# EAGLE schematic Zegar (EAGLE 5.06)
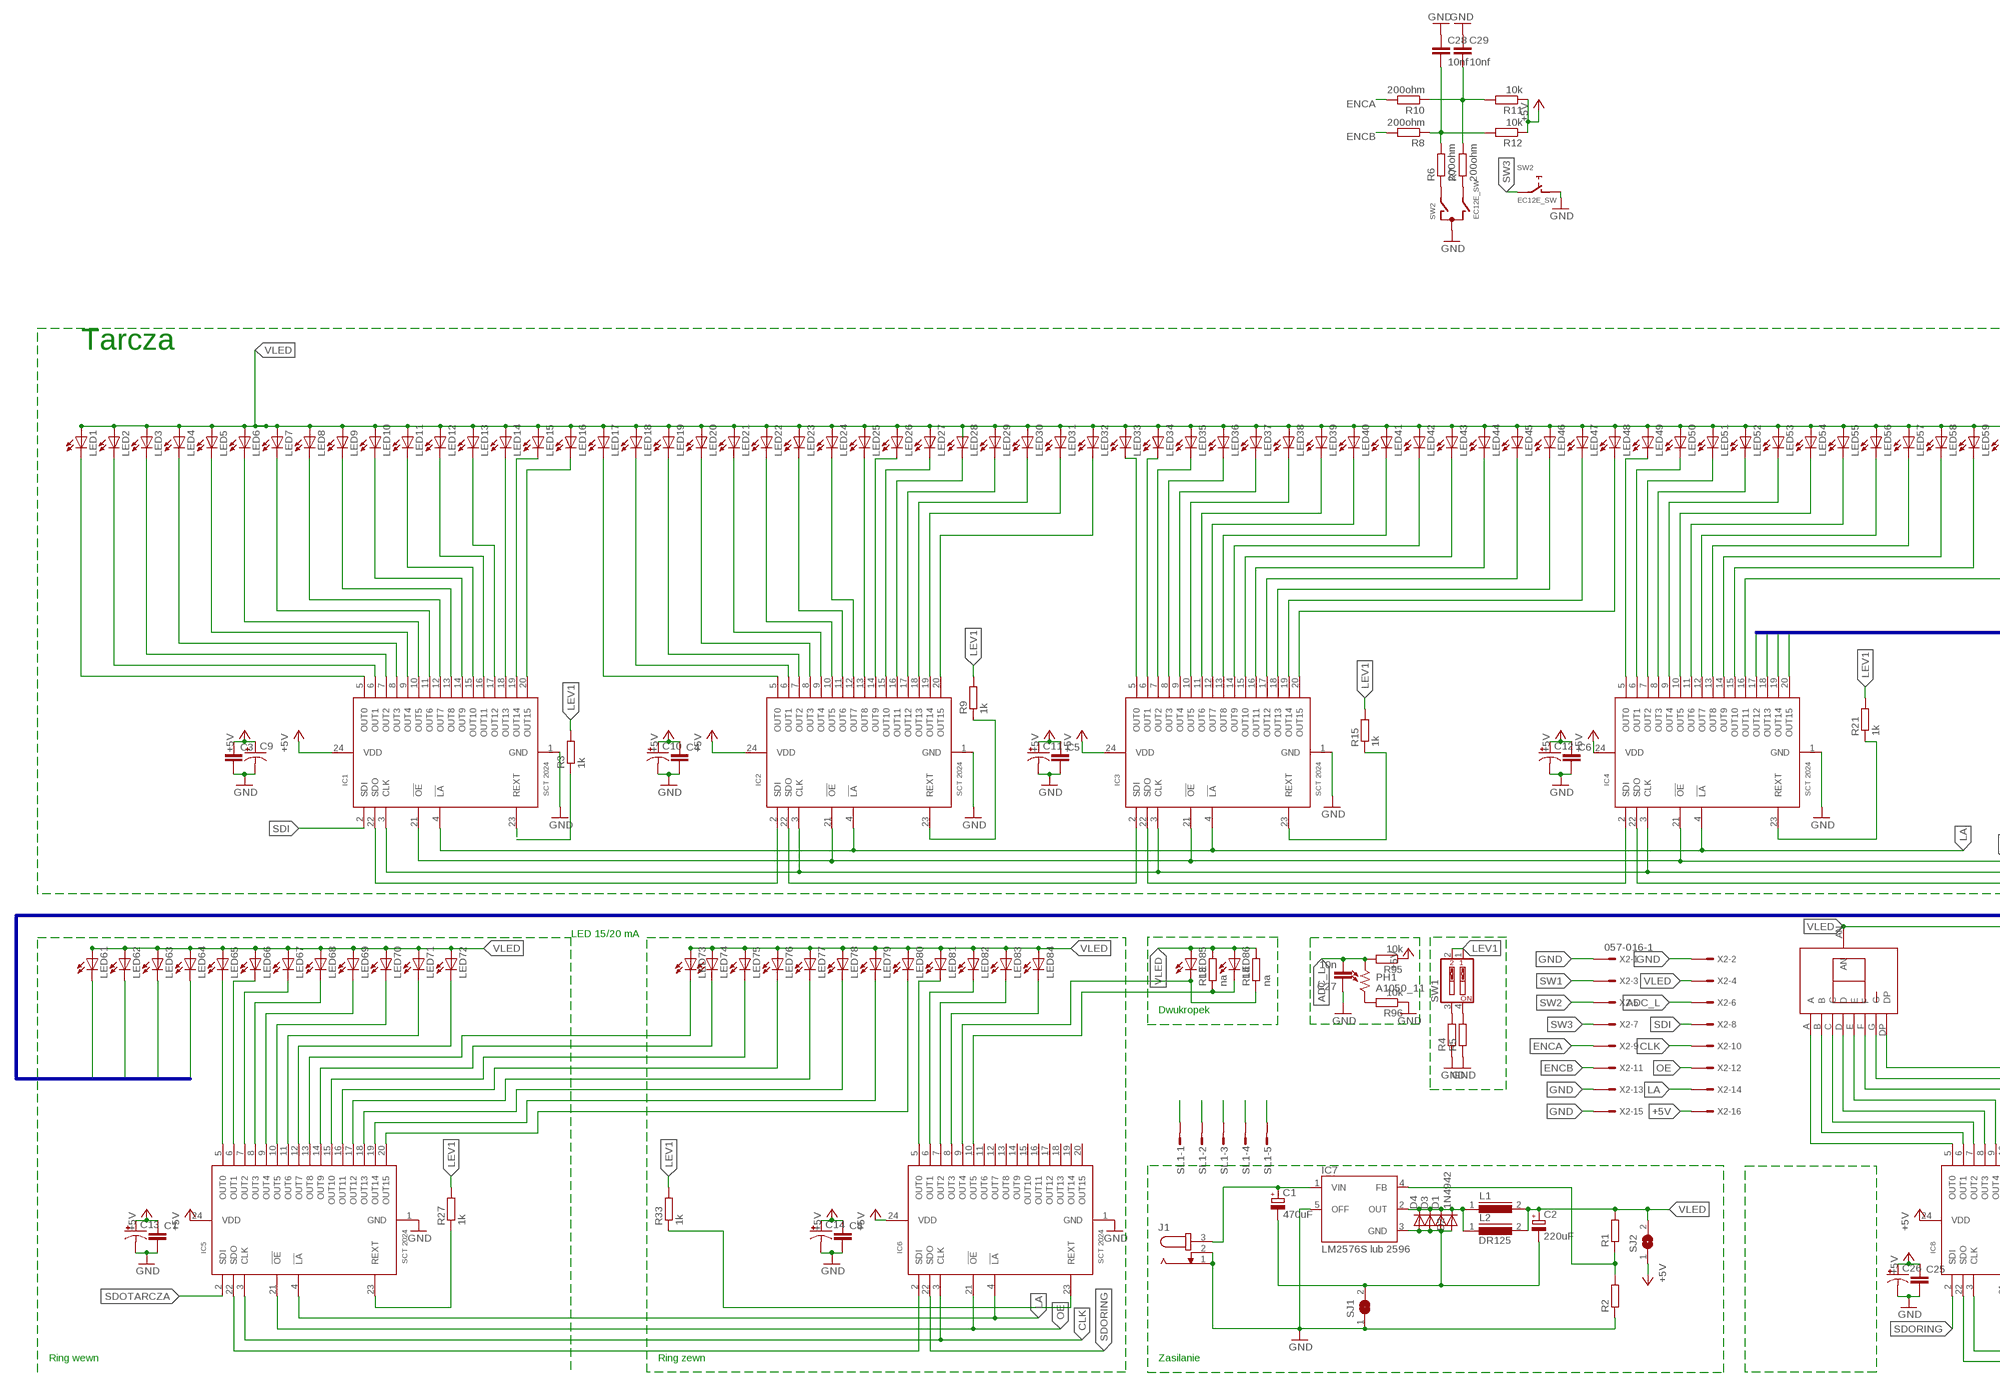
[diagram p0: schematic, sheet 1, part 1 of 2]
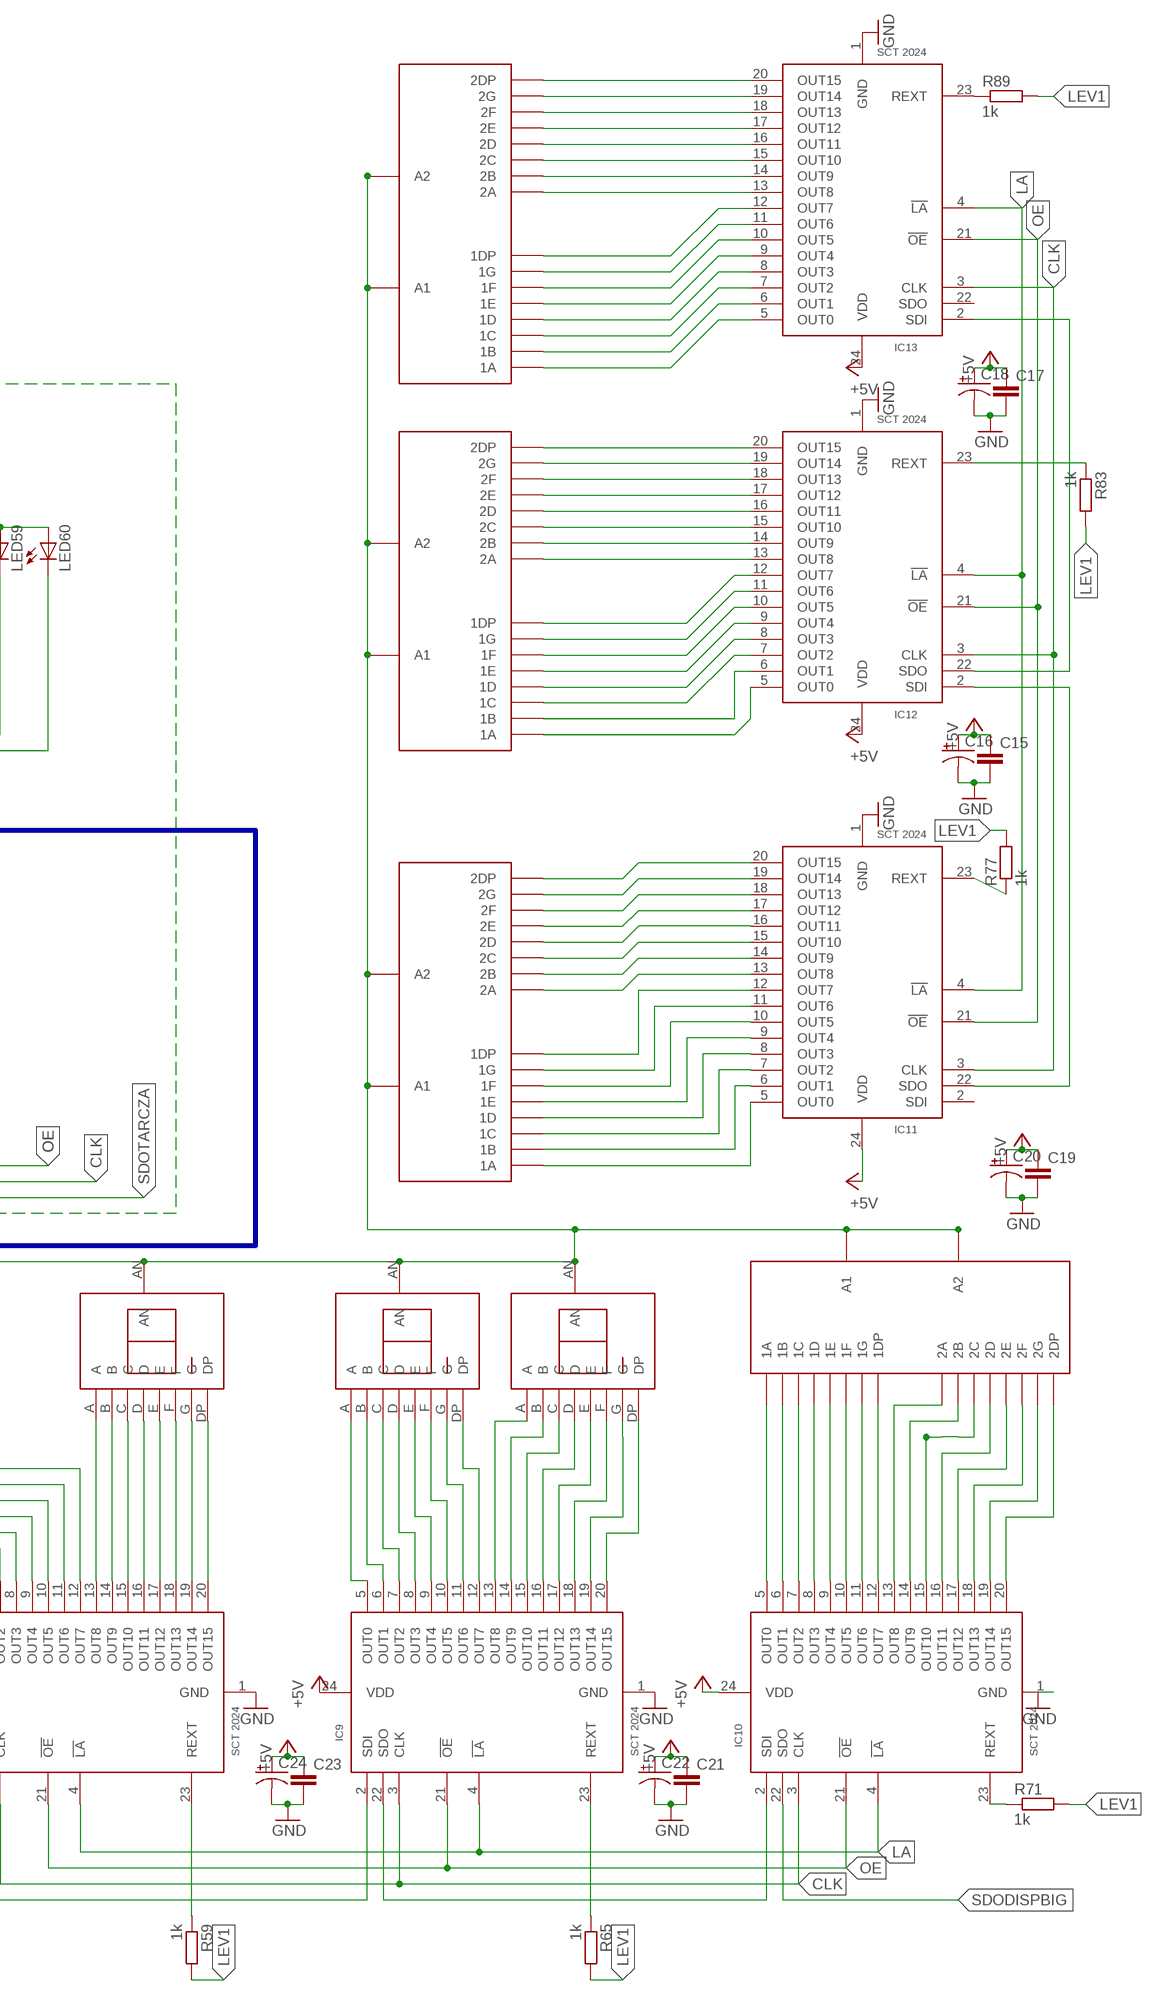
[diagram p1: schematic, sheet 1, part 2 of 2]

## Parts
C1  470uF  CPOL-EUE2.5-5  [E2,5-5]
C2  220uF  CPOL-EUE3.5-10  [E3,5-10]
C3  C-EUC1206K  [C1206K]
C4  C-EUC1206K  [C1206K]
C5  C-EUC1206K  [C1206K]
C6  C-EUC1206K  [C1206K]
C7  C-EUC1206K  [C1206K]
C8  C-EUC1206K  [C1206K]
C9  CPOL-USE/7260-38W  [E/7260-38W]
C10  CPOL-USE/7260-38W  [E/7260-38W]
C11  CPOL-USE/7260-38W  [E/7260-38W]
C12  CPOL-USE/7260-38W  [E/7260-38W]
C13  CPOL-USE/7260-38W  [E/7260-38W]
C14  CPOL-USE/7260-38W  [E/7260-38W]
C15  C-EUC1206K  [C1206K]
C16  CPOL-USE/7260-38W  [E/7260-38W]
C17  C-EUC1206K  [C1206K]
C18  CPOL-USE/7260-38W  [E/7260-38W]
C19  C-EUC1206K  [C1206K]
C20  CPOL-USE/7260-38W  [E/7260-38W]
C21  C-EUC1206K  [C1206K]
C22  CPOL-USE/7260-38W  [E/7260-38W]
C23  C-EUC1206K  [C1206K]
C24  CPOL-USE/7260-38W  [E/7260-38W]
C25  C-EUC1206K  [C1206K]
C26  CPOL-USE/7260-38W  [E/7260-38W]
C27  10n  C-EUC1206K  [C1206K]
C28  10nf  C-EUC1206K  [C1206K]
C29  10nf  C-EUC1206K  [C1206K]
D1  1N4942  [DO41-10]
D2  D-SMB  [SMB]
D3  DIODE-MELF-MLL41  [MELF-MLL41]
D4  DIODE-C2673  [C2673]
DL_S1  DISPL_LED_MALY_PODW_JJ  [DISPLEDMALYPODW]
DL_S2  DISPL_LED_MALY_PODW_JJ  [DISPLEDMALYPODW]
DL_S3  DISPL_LED_MALY_PODW_JJ  [DISPLEDMALYPODW]
DL_S4  DISPL_LED_MALY_PODW_JJ  [DISPLEDMALYPODW]
DUZY_JJ1  DISP-LED-DUZY-POL_JJ  [DISPLEDDUZYPOL]
DUZY_JJ2  DISP-LED-DUZY-POL_JJ  [DISPLEDDUZYPOL]
DUZY_JJ3  DISP-LED-DUZY-POL_JJ  [DISPLEDDUZYPOL]
DUZY_JJ4  DISP-LED-DUZY-POL_JJ  [DISPLEDDUZYPOL]
IC1  SCT 2024  SCT24  [SSOP24]
IC2  SCT 2024  SCT24  [SSOP24]
IC3  SCT 2024  SCT24  [SSOP24]
IC4  SCT 2024  SCT24  [SSOP24]
IC5  SCT 2024  SCT24  [SSOP24]
IC6  SCT 2024  SCT24  [SSOP24]
IC7  LM2576S lub 2596  LM2576S  [TO263-5]
IC8  SCT 2024  SCT24  [SSOP24]
IC9  SCT 2024  SCT24  [SSOP24]
IC10  SCT 2024  SCT24  [SSOP24]
IC11  SCT 2024  SCT24  [SSOP24]
IC12  SCT 2024  SCT24  [SSOP24]
IC13  SCT 2024  SCT24  [SSOP24]
J1  JACK-PLUG0  [SPC4077]
L1  R1705D10  [10-17]
L2  DR125  [DR125]
LED1  LED5MM  [LED5MM]
LED2  LED5MM  [LED5MM]
LED3  LED5MM  [LED5MM]
LED4  LED5MM  [LED5MM]
LED5  LED5MM  [LED5MM]
LED6  LED5MM  [LED5MM]
LED7  LED5MM  [LED5MM]
LED8  LED5MM  [LED5MM]
LED9  LED5MM  [LED5MM]
LED10  LED5MM  [LED5MM]
LED11  LED5MM  [LED5MM]
LED12  LED5MM  [LED5MM]
LED13  LED5MM  [LED5MM]
LED14  LED5MM  [LED5MM]
LED15  LED5MM  [LED5MM]
LED16  LED5MM  [LED5MM]
LED17  LED5MM  [LED5MM]
LED18  LED5MM  [LED5MM]
LED19  LED5MM  [LED5MM]
LED20  LED5MM  [LED5MM]
LED21  LED5MM  [LED5MM]
LED22  LED5MM  [LED5MM]
LED23  LED5MM  [LED5MM]
LED24  LED5MM  [LED5MM]
LED25  LED5MM  [LED5MM]
LED26  LED5MM  [LED5MM]
LED27  LED5MM  [LED5MM]
LED28  LED5MM  [LED5MM]
LED29  LED5MM  [LED5MM]
LED30  LED5MM  [LED5MM]
LED31  LED5MM  [LED5MM]
LED32  LED5MM  [LED5MM]
LED33  LED5MM  [LED5MM]
LED34  LED5MM  [LED5MM]
LED35  LED5MM  [LED5MM]
LED36  LED5MM  [LED5MM]
LED37  LED5MM  [LED5MM]
LED38  LED5MM  [LED5MM]
LED39  LED5MM  [LED5MM]
LED40  LED5MM  [LED5MM]
LED41  LED5MM  [LED5MM]
LED42  LED5MM  [LED5MM]
LED43  LED5MM  [LED5MM]
LED44  LED5MM  [LED5MM]
LED45  LED5MM  [LED5MM]
LED46  LED5MM  [LED5MM]
LED47  LED5MM  [LED5MM]
LED48  LED5MM  [LED5MM]
LED49  LED5MM  [LED5MM]
LED50  LED5MM  [LED5MM]
LED51  LED5MM  [LED5MM]
LED52  LED5MM  [LED5MM]
LED53  LED5MM  [LED5MM]
LED54  LED5MM  [LED5MM]
LED55  LED5MM  [LED5MM]
LED56  LED5MM  [LED5MM]
LED57  LED5MM  [LED5MM]
LED58  LED5MM  [LED5MM]
LED59  LED5MM  [LED5MM]
LED60  LED5MM  [LED5MM]
LED61  LED5MM  [LED5MM]
LED62  LED5MM  [LED5MM]
LED63  LED5MM  [LED5MM]
LED64  LED5MM  [LED5MM]
LED65  LED5MM  [LED5MM]
LED66  LED5MM  [LED5MM]
LED67  LED5MM  [LED5MM]
LED68  LED5MM  [LED5MM]
LED69  LED5MM  [LED5MM]
LED70  LED5MM  [LED5MM]
LED71  LED5MM  [LED5MM]
LED72  LED5MM  [LED5MM]
LED73  LED5MM  [LED5MM]
LED74  LED5MM  [LED5MM]
LED75  LED5MM  [LED5MM]
LED76  LED5MM  [LED5MM]
LED77  LED5MM  [LED5MM]
LED78  LED5MM  [LED5MM]
LED79  LED5MM  [LED5MM]
LED80  LED5MM  [LED5MM]
LED81  LED5MM  [LED5MM]
LED82  LED5MM  [LED5MM]
LED83  LED5MM  [LED5MM]
LED84  LED5MM  [LED5MM]
LED85  LED5MM  [LED5MM]
LED86  LED5MM  [LED5MM]
PH1  A1050_11  [T0-46-A10XX]
R1  R-EU_M1206  [M1206]
R2  R-EU_M1206  [M1206]
R3  1k  R-EU_R0805  [R0805]
R4  R-EU_R0805  [R0805]
R5  R-EU_R0805  [R0805]
R6  200ohm  R-EU_R0805  [R0805]
R7  200ohm  R-EU_R0805  [R0805]
R8  200ohm  R-EU_R0805  [R0805]
R9  1k  R-EU_R0805  [R0805]
R10  200ohm  R-EU_R0805  [R0805]
R11  10k  R-EU_R0805  [R0805]
R12  10k  R-EU_R0805  [R0805]
R13  na  R-EU_R0805  [R0805]
R14  na  R-EU_R0805  [R0805]
R15  1k  R-EU_R0805  [R0805]
R21  1k  R-EU_R0805  [R0805]
R27  1k  R-EU_R0805  [R0805]
R33  1k  R-EU_R0805  [R0805]
R59  1k  R-EU_R0805  [R0805]
R65  1k  R-EU_R0805  [R0805]
R71  1k  R-EU_R0805  [R0805]
R77  1k  R-EU_R0805  [R0805]
R83  1k  R-EU_R0805  [R0805]
R89  1k  R-EU_R0805  [R0805]
R95  10k  R-EU_R0805  [R0805]
R96  10k  R-EU_R0805  [R0805]
SJ1  SJW  [SJW]
SJ2  SJW  [SJW]
SL1  M05S  [05P]
SW1  SW_DIP-2  [EDG-02]
SW2  EC12E_SW  [ALPS_EC12E_SW]
X2  057-016-1  [057-016-1]

## Nets
+5V: C3.1 C4.1 C5.1 C6.1 C7.1 C8.1 C9.+ C10.+ C11.+ C12.+ C13.+ C14.+ C15.1 C16.+ C17.1 C18.+ C19.1 C20.+ C21.1 C22.+ C23.1 C24.+ C25.1 C26.+ IC1.24(VDD) IC2.24(VDD) IC3.24(VDD) IC4.24(VDD) IC5.24(VDD) IC6.24(VDD) IC8.24(VDD) IC9.24(VDD) IC10.24(VDD) IC11.24(VDD) IC12.24(VDD) IC13.24(VDD) R11.1 R12.1 R95.1 SJ2.1 X2.16
ADC_L: C27.2 PH1.1 R95.2 X2.6
B$2: IC4.17(OUT12) LED61.K(C)
B$3: IC4.18(OUT13) LED62.K(C)
B$4: IC4.19(OUT14) LED63.K(C)
B$5: IC4.20(OUT15) LED64.K(C)
CLK: IC1.3(CLK) IC2.3(CLK) IC3.3(CLK) IC4.3(CLK) IC5.3(CLK) IC6.3(CLK) IC8.3(CLK) IC9.3(CLK) IC10.3(CLK) IC11.3(CLK) IC12.3(CLK) IC13.3(CLK) SL1.4 X2.10
ENCA: R10.2 X2.9
ENCB: R8.2 X2.11
GND: C3.2 C4.2 C5.2 C6.2 C7.2 C8.2 C9.- C10.- C11.- C12.- C13.- C14.- C15.2 C16.- C17.2 C18.- C19.2 C20.- C21.2 C22.- C23.2 C24.- C25.2 C26.- C27.1 C28.1 C29.1 IC1.1(GND) IC2.1(GND) IC3.1(GND) IC4.1(GND) IC5.1(GND) IC6.1(GND) IC7.5(OFF) IC8.1(GND) IC9.1(GND) IC10.1(GND) IC11.1(GND) IC12.1(GND) IC13.1(GND) J1.1 J1.2 R2.1 R4.1 R5.1 R96.1 SJ1.1 SL1.1 SW2.C SW2.D X2.1 X2.2 X2.13 X2.15
LA: IC1.4(!LA) IC2.4(!LA) IC3.4(!LA) IC4.4(!LA) IC5.4(!LA) IC6.4(!LA) IC8.4(!LA) IC9.4(!LA) IC10.4(!LA) IC11.4(!LA) IC12.4(!LA) IC13.4(!LA) SL1.2 X2.14
LEV1: R3.2 R9.2 R15.2 R21.2 R27.2 R33.2 R59.2 R65.2 R71.2 R77.2 R83.2 R89.2 SW1.1 SW1.2
N$1: IC1.5(OUT0) LED1.K(C)
N$2: IC1.6(OUT1) LED2.K(C)
N$3: IC1.7(OUT2) LED3.K(C)
N$4: IC1.8(OUT3) LED4.K(C)
N$5: IC1.9(OUT4) LED5.K(C)
N$6: IC1.10(OUT5) LED6.K(C)
N$7: IC1.11(OUT6) LED7.K(C)
N$8: IC1.12(OUT7) LED8.K(C)
N$9: IC1.13(OUT8) LED9.K(C)
N$10: IC1.14(OUT9) LED10.K(C)
N$11: IC1.15(OUT10) LED11.K(C)
N$12: IC1.16(OUT11) LED12.K(C)
N$13: IC1.17(OUT12) LED13.K(C)
N$14: IC1.18(OUT13) LED14.K(C)
N$15: IC1.19(OUT14) LED15.K(C)
N$16: IC1.20(OUT15) LED16.K(C)
N$17: IC2.5(OUT0) LED17.K(C)
N$18: IC2.6(OUT1) LED18.K(C)
N$19: IC2.7(OUT2) LED19.K(C)
N$20: IC2.8(OUT3) LED20.K(C)
N$21: IC2.9(OUT4) LED21.K(C)
N$22: IC2.10(OUT5) LED22.K(C)
N$23: IC2.11(OUT6) LED23.K(C)
N$24: IC2.12(OUT7) LED24.K(C)
N$25: IC2.13(OUT8) LED25.K(C)
N$26: IC2.14(OUT9) LED26.K(C)
N$27: IC2.15(OUT10) LED27.K(C)
N$28: IC2.16(OUT11) LED28.K(C)
N$29: IC2.17(OUT12) LED29.K(C)
N$30: IC2.18(OUT13) LED30.K(C)
N$31: IC2.19(OUT14) LED31.K(C)
N$32: IC2.20(OUT15) LED32.K(C)
N$33: IC3.5(OUT0) LED33.K(C)
N$34: IC3.6(OUT1) LED34.K(C)
N$35: IC3.7(OUT2) LED35.K(C)
N$36: IC3.8(OUT3) LED36.K(C)
N$37: IC3.9(OUT4) LED37.K(C)
N$38: IC3.10(OUT5) LED38.K(C)
N$39: IC3.11(OUT6) LED39.K(C)
N$40: IC3.12(OUT7) LED40.K(C)
N$41: IC3.13(OUT8) LED41.K(C)
N$42: IC3.14(OUT9) LED42.K(C)
N$43: IC3.15(OUT10) LED43.K(C)
N$44: IC3.16(OUT11) LED44.K(C)
N$45: IC3.17(OUT12) LED45.K(C)
N$46: IC3.18(OUT13) LED46.K(C)
N$47: IC3.19(OUT14) LED47.K(C)
N$48: IC3.20(OUT15) LED48.K(C)
N$49: IC4.5(OUT0) LED49.K(C)
N$50: IC4.6(OUT1) LED50.K(C)
N$51: IC4.7(OUT2) LED51.K(C)
N$52: IC4.8(OUT3) LED52.K(C)
N$53: IC4.9(OUT4) LED53.K(C)
N$54: IC4.10(OUT5) LED54.K(C)
N$55: IC4.11(OUT6) LED55.K(C)
N$56: IC4.12(OUT7) LED56.K(C)
N$57: IC4.13(OUT8) LED57.K(C)
N$58: IC4.14(OUT9) LED58.K(C)
N$59: IC4.15(OUT10) LED59.K(C)
N$60: IC4.16(OUT11) LED60.K(C)
N$62: IC5.5(OUT0) LED65.K(C)
N$63: IC1.22(SDO) IC2.2(SDI)
N$64: IC2.22(SDO) IC3.2(SDI)
N$65: IC3.22(SDO) IC4.2(SDI)
N$66: IC5.6(OUT1) LED66.K(C)
N$67: IC5.7(OUT2) LED67.K(C)
N$68: IC5.8(OUT3) LED68.K(C)
N$69: IC5.9(OUT4) LED69.K(C)
N$70: IC5.10(OUT5) LED70.K(C)
N$71: IC5.11(OUT6) LED71.K(C)
N$72: IC5.12(OUT7) LED72.K(C)
N$73: IC5.13(OUT8) LED73.K(C)
N$74: IC5.14(OUT9) LED74.K(C)
N$75: IC5.15(OUT10) LED75.K(C)
N$76: IC5.16(OUT11) LED76.K(C)
N$77: IC5.17(OUT12) LED77.K(C)
N$78: IC5.18(OUT13) LED78.K(C)
N$79: IC5.19(OUT14) LED79.K(C)
N$80: IC5.20(OUT15) LED80.K(C)
N$84: IC5.22(SDO) IC6.2(SDI)
N$85: IC1.23(REXT) R3.1
N$86: IC2.23(REXT) R9.1
N$87: IC3.23(REXT) R15.1
N$88: DUZY_JJ1.A IC8.5(OUT0)
N$89: C1.+ IC7.1(VIN) J1.3
N$90: DUZY_JJ1.B IC8.6(OUT1)
N$91: D1.C D2.1(C) D3.C D4.C IC7.2(OUT) L1.1 L2.1
N$92: IC6.5(OUT0) LED81.K(C)
N$93: IC6.6(OUT1) LED82.K(C)
N$94: IC6.7(OUT2) LED83.K(C)
N$95: IC6.8(OUT3) LED84.K(C)
N$96: IC7.4(FB) R1.1 R2.2
N$97: DUZY_JJ1.C IC8.7(OUT2)
N$99: C1.- C2.- D1.A D2.2(A) D3.A D4.A IC7.3(GND) SJ1.2
N$101: IC4.23(REXT) R21.1
N$102: IC5.23(REXT) R27.1
N$103: IC6.23(REXT) R33.1
N$104: DUZY_JJ1.D IC8.8(OUT3)
N$106: DUZY_JJ1.E IC8.9(OUT4)
N$107: DUZY_JJ1.F IC8.10(OUT5)
N$108: R6.1 SW2.A
N$111: R7.1 SW2.B
N$113: DUZY_JJ1.G IC8.11(OUT6)
N$114: C29.2 R7.2 R10.1 R11.2
N$115: DUZY_JJ1.DP IC8.12(OUT7)
N$116: IC6.9(OUT4) LED85.K(C) R14.1
N$117: IC6.10(OUT5) LED86.K(C) R13.1
N$118: C28.2 R6.2 R8.1 R12.2
N$119: DUZY_JJ2.A IC8.13(OUT8)
N$120: DUZY_JJ2.B IC8.14(OUT9)
N$121: DUZY_JJ2.C IC8.15(OUT10)
N$122: DUZY_JJ2.D IC8.16(OUT11)
N$123: DUZY_JJ2.E IC8.17(OUT12)
N$124: DUZY_JJ2.F IC8.18(OUT13)
N$125: DUZY_JJ2.G IC8.19(OUT14)
N$126: DUZY_JJ2.DP IC8.20(OUT15)
N$127: DUZY_JJ3.A IC9.5(OUT0)
N$128: DUZY_JJ3.B IC9.6(OUT1)
N$129: DUZY_JJ3.C IC9.7(OUT2)
N$130: DUZY_JJ3.D IC9.8(OUT3)
N$131: DUZY_JJ3.E IC9.9(OUT4)
N$133: DUZY_JJ3.F IC9.10(OUT5)
N$134: DUZY_JJ3.G IC9.11(OUT6)
N$135: DUZY_JJ3.DP IC9.12(OUT7)
N$136: DUZY_JJ4.A IC9.13(OUT8)
N$137: DUZY_JJ4.B IC9.14(OUT9)
N$138: DUZY_JJ4.C IC9.15(OUT10)
N$139: DUZY_JJ4.D IC9.16(OUT11)
N$140: DUZY_JJ4.E IC9.17(OUT12)
N$141: DUZY_JJ4.F IC9.18(OUT13)
N$142: DUZY_JJ4.G IC9.19(OUT14)
N$143: DL_S2.1A IC11.5(OUT0)
N$144: DUZY_JJ4.DP IC9.20(OUT15)
N$145: DL_S1.1A IC10.5(OUT0)
N$146: DL_S1.1B IC10.6(OUT1)
N$147: DL_S1.1C IC10.7(OUT2)
N$148: DL_S1.1D IC10.8(OUT3)
N$149: DL_S1.1E IC10.9(OUT4)
N$150: DL_S1.1F IC10.10(OUT5)
N$151: DL_S1.1G IC10.11(OUT6)
N$152: DL_S1.1DP IC10.12(OUT7)
N$153: DL_S1.2A IC10.13(OUT8)
N$154: DL_S1.2B IC10.14(OUT9)
N$155: DL_S1.2C IC10.15(OUT10)
N$156: DL_S1.2D IC10.16(OUT11)
N$157: DL_S1.2E IC10.17(OUT12)
N$158: DL_S1.2F IC10.18(OUT13)
N$159: DL_S1.2G IC10.19(OUT14)
N$160: DL_S1.2DP IC10.20(OUT15)
N$161: DL_S2.1B IC11.6(OUT1)
N$162: DL_S2.1C IC11.7(OUT2)
N$163: DL_S2.1D IC11.8(OUT3)
N$164: DL_S2.1E IC11.9(OUT4)
N$165: DL_S2.1F IC11.10(OUT5)
N$166: DL_S2.1G IC11.11(OUT6)
N$167: DL_S2.1DP IC11.12(OUT7)
N$168: DL_S2.2A IC11.13(OUT8)
N$169: DL_S2.2B IC11.14(OUT9)
N$170: DL_S2.2C IC11.15(OUT10)
N$171: DL_S2.2D IC11.16(OUT11)
N$172: IC8.22(SDO) IC9.2(SDI)
N$173: IC9.22(SDO) IC10.2(SDI)
N$174: DL_S2.2E IC11.17(OUT12)
N$175: DL_S2.2F IC11.18(OUT13)
N$176: DL_S2.2G IC11.19(OUT14)
N$177: DL_S2.2DP IC11.20(OUT15)
N$178: DL_S3.1A IC12.5(OUT0)
N$179: DL_S3.1B IC12.6(OUT1)
N$180: DL_S3.1C IC12.7(OUT2)
N$181: DL_S3.1D IC12.8(OUT3)
N$182: DL_S3.1E IC12.9(OUT4)
N$183: DL_S3.1F IC12.10(OUT5)
N$184: DL_S3.1G IC12.11(OUT6)
N$185: DL_S3.1DP IC12.12(OUT7)
N$186: DL_S3.2A IC12.13(OUT8)
N$187: DL_S3.2B IC12.14(OUT9)
N$188: DL_S3.2C IC12.15(OUT10)
N$189: DL_S3.2D IC12.16(OUT11)
N$190: DL_S3.2E IC12.17(OUT12)
N$191: DL_S3.2F IC12.18(OUT13)
N$192: DL_S3.2G IC12.19(OUT14)
N$193: DL_S3.2DP IC12.20(OUT15)
N$194: DL_S4.1A IC13.5(OUT0)
N$195: DL_S4.1B IC13.6(OUT1)
N$196: DL_S4.1C IC13.7(OUT2)
N$197: DL_S4.1D IC13.8(OUT3)
N$198: DL_S4.1E IC13.9(OUT4)
N$199: DL_S4.1F IC13.10(OUT5)
N$200: DL_S4.1G IC13.11(OUT6)
N$201: DL_S4.1DP IC13.12(OUT7)
N$202: DL_S4.2A IC13.13(OUT8)
N$203: DL_S4.2B IC13.14(OUT9)
N$204: DL_S4.2C IC13.15(OUT10)
N$205: DL_S4.2D IC13.16(OUT11)
N$206: DL_S4.2E IC13.17(OUT12)
N$207: DL_S4.2F IC13.18(OUT13)
N$208: DL_S4.2G IC13.19(OUT14)
N$209: DL_S4.2DP IC13.20(OUT15)
N$210: R4.2 SW1.3
N$211: R5.2 SW1.4
N$221: IC11.22(SDO) IC12.2(SDI)
N$222: IC12.22(SDO) IC13.2(SDI)
N$223: IC8.23(REXT) R59.1
N$224: IC9.23(REXT) R65.1
N$225: IC10.23(REXT) R71.1
N$226: IC11.23(REXT) R77.1
N$227: IC12.23(REXT) R83.1
N$228: IC13.23(REXT) R89.1
N$230: PH1.2 R96.2
OE: IC1.21(!OE) IC2.21(!OE) IC3.21(!OE) IC4.21(!OE) IC5.21(!OE) IC6.21(!OE) IC8.21(!OE) IC9.21(!OE) IC10.21(!OE) IC11.21(!OE) IC12.21(!OE) IC13.21(!OE) SL1.3 X2.12
SDI: IC1.2(SDI) SL1.5 X2.8
SDODISPBIG: IC10.22(SDO)
SDORING: IC6.22(SDO) IC8.2(SDI)
SDOTARCZA: IC4.22(SDO) IC5.2(SDI)
SW1: X2.3
SW2: X2.5
SW3: SW2.E X2.7
VLED: C2.+ DL_S1.AN1(A1) DL_S1.AN2(A2) DL_S2.AN1(A1) DL_S2.AN2(A2) DL_S3.AN1(A1) DL_S3.AN2(A2) DL_S4.AN1(A1) DL_S4.AN2(A2) DUZY_JJ1.AN DUZY_JJ2.AN DUZY_JJ3.AN DUZY_JJ4.AN L1.2 L2.2 LED1.A LED2.A LED3.A LED4.A LED5.A LED6.A LED7.A LED8.A LED9.A LED10.A LED11.A LED12.A LED13.A LED14.A LED15.A LED16.A LED17.A LED18.A LED19.A LED20.A LED21.A LED22.A LED23.A LED24.A LED25.A LED26.A LED27.A LED28.A LED29.A LED30.A LED31.A LED32.A LED33.A LED34.A LED35.A LED36.A LED37.A LED38.A LED39.A LED40.A LED41.A LED42.A LED43.A LED44.A LED45.A LED46.A LED47.A LED48.A LED49.A LED50.A LED51.A LED52.A LED53.A LED54.A LED55.A LED56.A LED57.A LED58.A LED59.A LED60.A LED61.A LED62.A LED63.A LED64.A LED65.A LED66.A LED67.A LED68.A LED69.A LED70.A LED71.A LED72.A LED73.A LED74.A LED75.A LED76.A LED77.A LED78.A LED79.A LED80.A LED81.A LED82.A LED83.A LED84.A LED85.A LED86.A R1.2 R13.2 R14.2 SJ2.2 X2.4
Unconnected: IC6.11(OUT6) IC6.12(OUT7) IC6.13(OUT8) IC6.14(OUT9) IC6.15(OUT10) IC6.16(OUT11) IC6.17(OUT12) IC6.18(OUT13) IC6.19(OUT14) IC6.20(OUT15) IC11.2(SDI) IC13.22(SDO) SW2.GND1(G) SW2.GND2(G)

## Buses
B$1

## Notes on the sheet
- Tarcza
- LED 15/20 mA
- Dwukropek
- Ring wewn | Ring zewn | Zasilanie

## Library data of the parts
C1 C2 = rcl:CPOL-EU: POLARIZED CAPACITOR, European symbol
C3-C8 C15 C17 C19 C21 C23 C25 C27-C29 = rcl:C-EU: CAPACITOR, European symbol
C9-C14 C16 C18 C20 C22 C24 C26 = rcl:CPOL-US: POLARIZED CAPACITOR, American symbol
D1 = diode:1N4942: DIODE 1.0 A, 200 V, 150 ns
D2 = semicon-smd-ipc:D-: DIODE unfilled
D3 D4 = diode:DIODE-: DIODE
DL_S1-DL_S4 = JJ_LED:DISPL_LED_MALY_PODW_JJ
DUZY_JJ1-DUZY_JJ4 = JJ_LED:DISP-LED-DUZY-POL_JJ
IC1-IC6 IC8-IC13 = StarChips:SCT24
IC7 = v-reg-3(1):LM2576: National Semiconductor <http://www.national.com> 3.0A "Simple Switcher"(c) 52kHz, Vout 1.23-37V (HV: 57V), Vin 40V (HV: 60V), 50µA standby current
J1 = con-jack:JACK-PLUG: DC POWER JACK Power Jack, DC, Right Angle, Through Hole, Rated 5A at 16VDC, PC Terminals Distributor: Farnell (www.Farnell.de) Drawing: 84N1161.pdf / 84N1162.pdf Manufacturer: SPC Technology (www.spctechnology.com) Type: SPC4077 / SPC 4078
L1 = inductor-nkl:R1705D: Speicherdrossel (bis typ. 250kHz) storage choke (up to typ. 250kHz)
L2 = inductors:DR125: High Power Density, High Efficiency, Shielded Inductors Source: coiltronics_dr_series.pdf
LED1-LED86 = led:LED: LED OSRAM: - CHIPLED LG R971, LG N971, LY N971, LG Q971, LY Q971, LO R971, LY R971 LH N974, LH R974 LS Q976, LO Q976, LY Q976 LO Q996 - Hyper CHIPLED LW Q18S LB Q993, LB Q99A, LB R99A - SideLED LS A670, LO A670, LY A670, LG A670, LP A670 LB A673, LV A673, LT A673, LW A673 LH A674 LY A675 LS A676, LA A676, LO A676, LY A676, LW A676 LS A679, LY A679, LG A679 - Hyper Micro SIDELED® LS Y876, LA Y876, LO Y876, LY Y876 LT Y87S - SmartLED LW L88C, LW L88S LB L89C, LB L89S, LG L890 LS L89K, LO L89K, LY L89K LS L896, LA L896, LO L896, LY L896 - TOPLED LS T670, LO T670, LY T670, LG T670, LP T670 LSG T670, LSP T670, LSY T670, LOP T670, LYG T670 LG T671, LOG T671, LSG T671 LB T673, LV T673, LT T673, LW T673 LH T674 LS T676, LA T676, LO T676, LY T676, LB T676, LH T676, LSB T676, LW T676 LB T67C, LV T67C, LT T67C, LS T67K, LO T67K, LY T67K, LW E67C LS E67B, LA E67B, LO E67B, LY E67B, LB E67C, LV E67C, LT E67C LW T67C LS T679, LY T679, LG T679 LS T770, LO T770, LY T770, LG T770, LP T770 LB T773, LV T773, LT T773, LW T773 LH T774 LS E675, LA E675, LY E675, LS T675 LS T776, LA T776, LO T776, LY T776, LB T776 LHGB T686 LT T68C, LB T68C - Hyper Mini TOPLED® LB M676 - Mini TOPLED Santana® LG M470 LS M47K, LO M47K, LY M47K Source: http://www.osram.convergy.de LUXEON: - LUMILED® LXK2-PW12-R00, LXK2-PW12-S00, LXK2-PW14-U00, LXK2-PW14-V00 LXK2-PM12-R00, LXK2-PM12-S00, LXK2-PM14-U00 LXK2-PE12-Q00, LXK2-PE12-R00, LXK2-PE12-S00, LXK2-PE14-T00, LXK2-PE14-U00 LXK2-PB12-K00, LXK2-PB12-L00, LXK2-PB12-M00, LXK2-PB14-N00, LXK2-PB14-P00, LXK2-PB14-Q00 LXK2-PR12-L00, LXK2-PR12-M00, LXK2-PR14-Q00, LXK2-PR14-R00 LXK2-PD12-Q00, LXK2-PD12-R00, LXK2-PD12-S00 LXK2-PH12-R00, LXK2-PH12-S00 LXK2-PL12-P00, LXK2-PL12-Q00, LXK2-PL12-R00 Source: www.luxeon.com KINGBRIGHT: KA-3528ASYC Source: www.kingbright.com
PH1 = photo-elements:A10: Sensor Robust Light Sensing Applications Outdoor Light Sensing Application Source: http://optoelectronics.perkinelmer.com/content/Datasheets/DTS_PhotocellsA1050.pdf
R1-R15 R21 R27 R33 R59 R65 R71 R77 R83 R89 R95 R96 = rcl:R-EU_: RESISTOR, European symbol
SJ1 SJ2 = jumper:SJ: SMD solder JUMPER
SL1 = con-amp-quick:M05S: AMP QUICK CONNECTOR
SW1 = special:SW_DIP-2: DIP SWITCH
SW2 = switch-alps:EC12E_SW: ALPS rotary Encoder EC12E series with switch
X2 = con-panduit:057-016-: CONNECTOR 10-pin series 057 contact pc board low profile headers